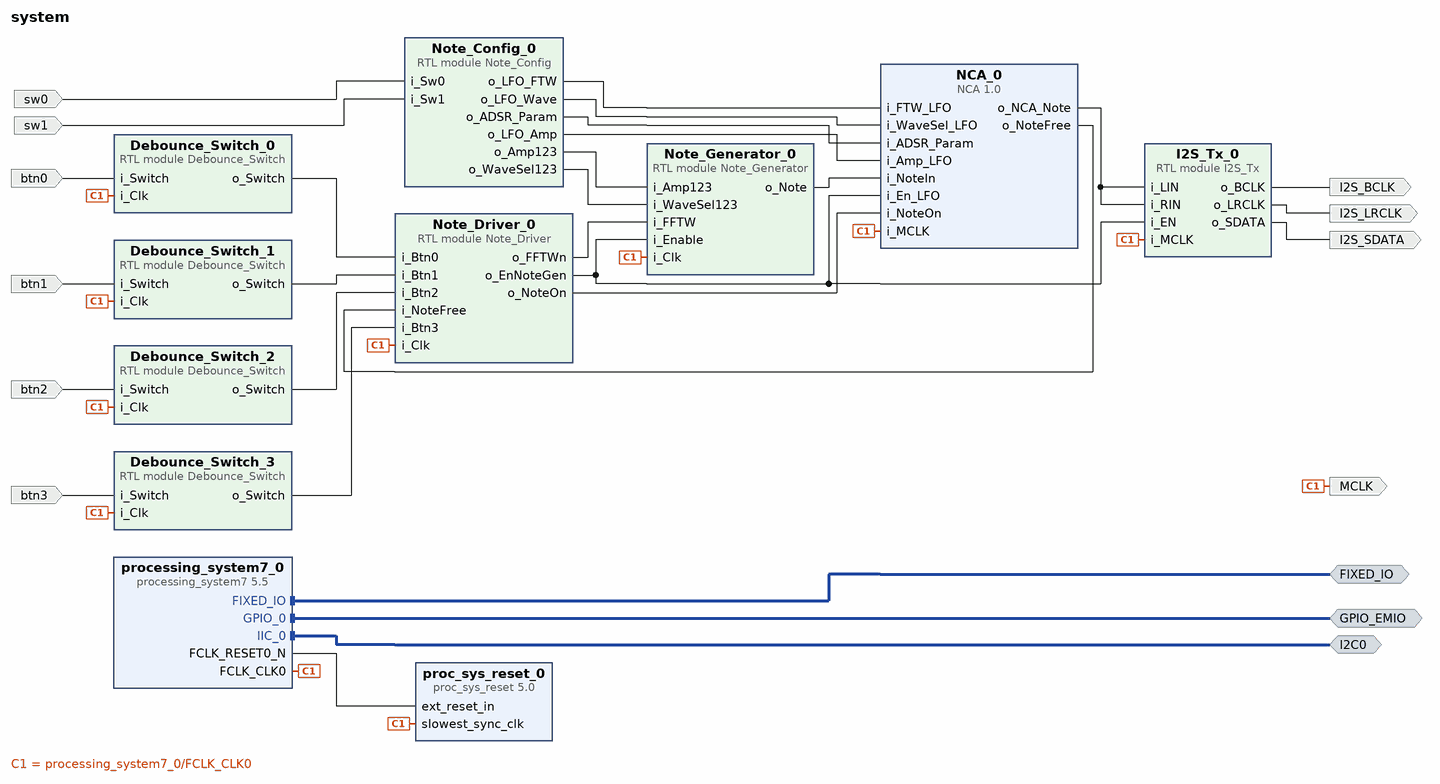
[diagram p0: block diagram of the top level]
# Vivado block design system, xc7z020clg400-1, Vivado 2020.2
create_bd_design system

create_bd_intf_port -mode Master -vlnv xilinx.com:display_processing_system7:fixedio_rtl:1.0 FIXED_IO
create_bd_intf_port -mode Master -vlnv xilinx.com:interface:gpio_rtl:1.0 GPIO_EMIO
create_bd_intf_port -mode Master -vlnv xilinx.com:interface:iic_rtl:1.0 I2C0
create_bd_port -dir I sw0
create_bd_port -dir I sw1
create_bd_port -dir I btn0
create_bd_port -dir I btn1
create_bd_port -dir I btn2
create_bd_port -dir I btn3
create_bd_port -dir O I2S_BCLK
create_bd_port -dir O I2S_LRCLK
create_bd_port -dir O I2S_SDATA
create_bd_port -dir O -type clk MCLK
set_property -dict {CONFIG.FREQ_HZ 12264151} [get_bd_ports MCLK]

create_bd_cell -type ip -vlnv xilinx.com:ip:processing_system7:5.5 processing_system7_0
set_property -dict [list \
  CONFIG.PCW_APU_PERIPHERAL_FREQMHZ 650 \
  CONFIG.PCW_CRYSTAL_PERIPHERAL_FREQMHZ 50 \
  CONFIG.PCW_ENET0_PERIPHERAL_ENABLE 0 \
  CONFIG.PCW_FCLK0_PERIPHERAL_CLKSRC {ARM PLL} \
  CONFIG.PCW_FPGA0_PERIPHERAL_FREQMHZ 12.288 \
  CONFIG.PCW_FPGA1_PERIPHERAL_FREQMHZ 50 \
  CONFIG.PCW_GPIO_EMIO_GPIO_ENABLE 1 \
  CONFIG.PCW_GPIO_EMIO_GPIO_IO 2 \
  CONFIG.PCW_GPIO_EMIO_GPIO_WIDTH 2 \
  CONFIG.PCW_GPIO_MIO_GPIO_ENABLE 0 \
  CONFIG.PCW_I2C0_I2C0_IO EMIO \
  CONFIG.PCW_I2C0_PERIPHERAL_ENABLE 1 \
  CONFIG.PCW_I2C_PERIPHERAL_FREQMHZ 108.333336 \
  CONFIG.PCW_PERIPHERAL_BOARD_PRESET None \
  CONFIG.PCW_PRESET_BANK1_VOLTAGE {LVCMOS 1.8V} \
  CONFIG.PCW_QSPI_PERIPHERAL_ENABLE 0 \
  CONFIG.PCW_SD0_PERIPHERAL_ENABLE 0 \
  CONFIG.PCW_SDIO_PERIPHERAL_FREQMHZ 50 \
  CONFIG.PCW_UART1_PERIPHERAL_ENABLE 0 \
  CONFIG.PCW_UART_PERIPHERAL_FREQMHZ 100 \
  CONFIG.PCW_UIPARAM_DDR_ENABLE 0 \
  CONFIG.PCW_USB0_PERIPHERAL_ENABLE 1 \
  CONFIG.PCW_USB0_USB0_IO {MIO 28 .. 39} \
  CONFIG.PCW_USE_M_AXI_GP0 0 \
] [get_bd_cells processing_system7_0]
# 325 more settings of processing_system7_0 are not shown: defaults, MIO pin electricals, DDR timing, and values the tool derives
create_bd_cell -type ip -vlnv xilinx.com:ip:proc_sys_reset:5.0 proc_sys_reset_0
create_bd_cell -type module -reference Note_Driver Note_Driver_0
create_bd_cell -type module -reference Note_Config Note_Config_0
create_bd_cell -type module -reference I2S_Tx I2S_Tx_0
create_bd_cell -type ip -vlnv rtlogik:user:NCA:1.0 NCA_0
create_bd_cell -type module -reference Debounce_Switch Debounce_Switch_0
create_bd_cell -type module -reference Debounce_Switch Debounce_Switch_1
create_bd_cell -type module -reference Debounce_Switch Debounce_Switch_2
create_bd_cell -type module -reference Debounce_Switch Debounce_Switch_3
create_bd_cell -type module -reference Note_Generator Note_Generator_0
set_property -dict {CONFIG.g_FFTW_WIDTH 24} [get_bd_cells Note_Generator_0]

# ---- connections ----

connect_bd_intf_net [get_bd_intf_ports FIXED_IO] [get_bd_intf_pins processing_system7_0/FIXED_IO]
connect_bd_intf_net [get_bd_intf_ports GPIO_EMIO] [get_bd_intf_pins processing_system7_0/GPIO_0]
connect_bd_intf_net [get_bd_intf_ports I2C0] [get_bd_intf_pins processing_system7_0/IIC_0]
connect_bd_net [get_bd_pins processing_system7_0/FCLK_RESET0_N] [get_bd_pins proc_sys_reset_0/ext_reset_in]
connect_bd_net [get_bd_pins NCA_0/o_NoteFree] [get_bd_pins Note_Driver_0/i_NoteFree]
connect_bd_net -net i_Sw0_0_1 [get_bd_ports sw0] [get_bd_pins Note_Config_0/i_Sw0]
connect_bd_net -net i_Sw1_0_1 [get_bd_ports sw1] [get_bd_pins Note_Config_0/i_Sw1]
connect_bd_net [get_bd_pins Debounce_Switch_0/o_Switch] [get_bd_pins Note_Driver_0/i_Btn0]
connect_bd_net [get_bd_pins Debounce_Switch_1/o_Switch] [get_bd_pins Note_Driver_0/i_Btn1]
connect_bd_net [get_bd_pins Debounce_Switch_2/o_Switch] [get_bd_pins Note_Driver_0/i_Btn2]
connect_bd_net [get_bd_pins Debounce_Switch_3/o_Switch] [get_bd_pins Note_Driver_0/i_Btn3]
connect_bd_net -net i_Switch_0_1 [get_bd_ports btn0] [get_bd_pins Debounce_Switch_0/i_Switch]
connect_bd_net -net i_Switch_1_1 [get_bd_ports btn1] [get_bd_pins Debounce_Switch_1/i_Switch]
connect_bd_net -net i_Switch_2_1 [get_bd_ports btn2] [get_bd_pins Debounce_Switch_2/i_Switch]
connect_bd_net -net i_Switch_3_1 [get_bd_ports btn3] [get_bd_pins Debounce_Switch_3/i_Switch]
connect_bd_net [get_bd_pins Note_Driver_0/o_NoteOn] [get_bd_pins NCA_0/i_NoteOn]
connect_bd_net [get_bd_pins Note_Driver_0/o_FFTWn] [get_bd_pins Note_Generator_0/i_FFTW]
connect_bd_net [get_bd_pins Note_Config_0/o_Amp123] [get_bd_pins Note_Generator_0/i_Amp123]
connect_bd_net [get_bd_pins Note_Config_0/o_WaveSel123] [get_bd_pins Note_Generator_0/i_WaveSel123]
connect_bd_net [get_bd_pins Note_Driver_0/o_EnNoteGen] \
  [get_bd_pins NCA_0/i_En_LFO] [get_bd_pins I2S_Tx_0/i_EN] [get_bd_pins Note_Generator_0/i_Enable]
connect_bd_net [get_bd_pins Note_Config_0/o_LFO_FTW] [get_bd_pins NCA_0/i_FTW_LFO]
connect_bd_net [get_bd_pins Note_Generator_0/o_Note] [get_bd_pins NCA_0/i_NoteIn]
connect_bd_net [get_bd_pins Note_Config_0/o_LFO_Wave] [get_bd_pins NCA_0/i_WaveSel_LFO]
connect_bd_net [get_bd_pins Note_Config_0/o_ADSR_Param] [get_bd_pins NCA_0/i_ADSR_Param]
connect_bd_net [get_bd_pins Note_Config_0/o_LFO_Amp] [get_bd_pins NCA_0/i_Amp_LFO]
connect_bd_net [get_bd_pins NCA_0/o_NCA_Note] [get_bd_pins I2S_Tx_0/i_LIN] [get_bd_pins I2S_Tx_0/i_RIN]
connect_bd_net [get_bd_pins I2S_Tx_0/o_BCLK] [get_bd_ports I2S_BCLK]
connect_bd_net [get_bd_pins I2S_Tx_0/o_LRCLK] [get_bd_ports I2S_LRCLK]
connect_bd_net [get_bd_pins I2S_Tx_0/o_SDATA] [get_bd_ports I2S_SDATA]
connect_bd_net [get_bd_pins processing_system7_0/FCLK_CLK0] \
  [get_bd_ports MCLK] [get_bd_pins Debounce_Switch_3/i_Clk] [get_bd_pins Debounce_Switch_2/i_Clk] \
  [get_bd_pins Debounce_Switch_1/i_Clk] [get_bd_pins Debounce_Switch_0/i_Clk] [get_bd_pins Note_Driver_0/i_Clk] \
  [get_bd_pins NCA_0/i_MCLK] [get_bd_pins I2S_Tx_0/i_MCLK] [get_bd_pins proc_sys_reset_0/slowest_sync_clk] \
  [get_bd_pins Note_Generator_0/i_Clk]
set_property PFM.AXI_PORT {M_AXI_GP0 {memport "M_AXI_GP" sptag "" memory "" is_range "false"}} [get_bd_cells processing_system7_0]
set_property PFM.CLOCK {FCLK_CLK0 {id "0" is_default "true" proc_sys_reset "/proc_sys_reset_0" status "fixed" freq_hz "12264151"}} [get_bd_cells processing_system7_0]

validate_bd_design
save_bd_design
